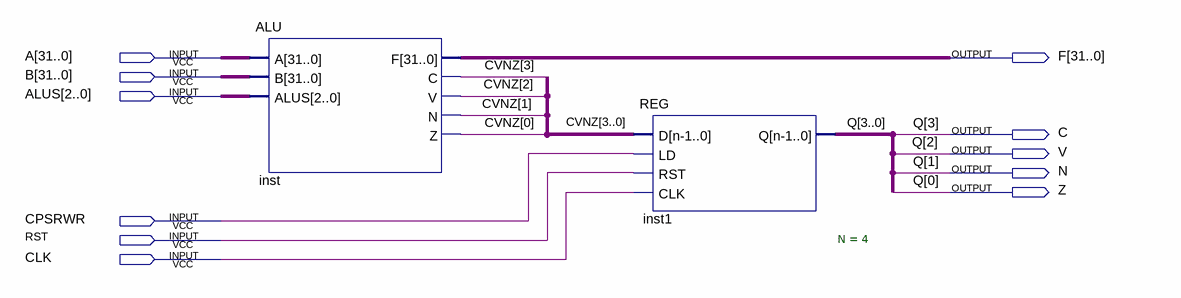
[diagram p0: schematic sheet]
// Quartus schematic EXECUTE.bdf as structural Verilog: 2 symbols, 11 pins
module EXECUTE (
  input  [31:0] A,
  input  [31:0] B,
  input  [2:0] ALUS,
  input  CPSRWR,
  input  RST,
  input  CLK,
  output [31:0] F,
  output C,
  output V,
  output N,
  output Z
);

  wire [3:0] CVNZ;

  ALU inst (.A(A), .B(B), .ALUS(ALUS), .F(F), .C(CVNZ[3]), .V(CVNZ[2]), .N(CVNZ[1]), .Z(CVNZ[0]));
  REG #(.N(4)) inst1 (.D(CVNZ), .LD(CPSRWR), .RST(RST), .CLK(CLK), .Q({C, V, N, Z}));

  // Other names for the same wires on the sheet: Q[3:0] = {C, V, N, Z}
endmodule
